# EasyEDA Pro project ProProject_Hauptplatine_ESP32.epro, schematic Schematic1
Create Date: 2024-03-31; Page Name: P1; Project Name: Hauptplatine_ESP32; Schematic Name: Schematic1; Update Date: 2024-03-31; Company: EasyEDA.com; Drawn: EasyEDA; Page Size: A4; Part Number: JLCPCB-002; Reviewed: EasyEDA; Version: V0.1
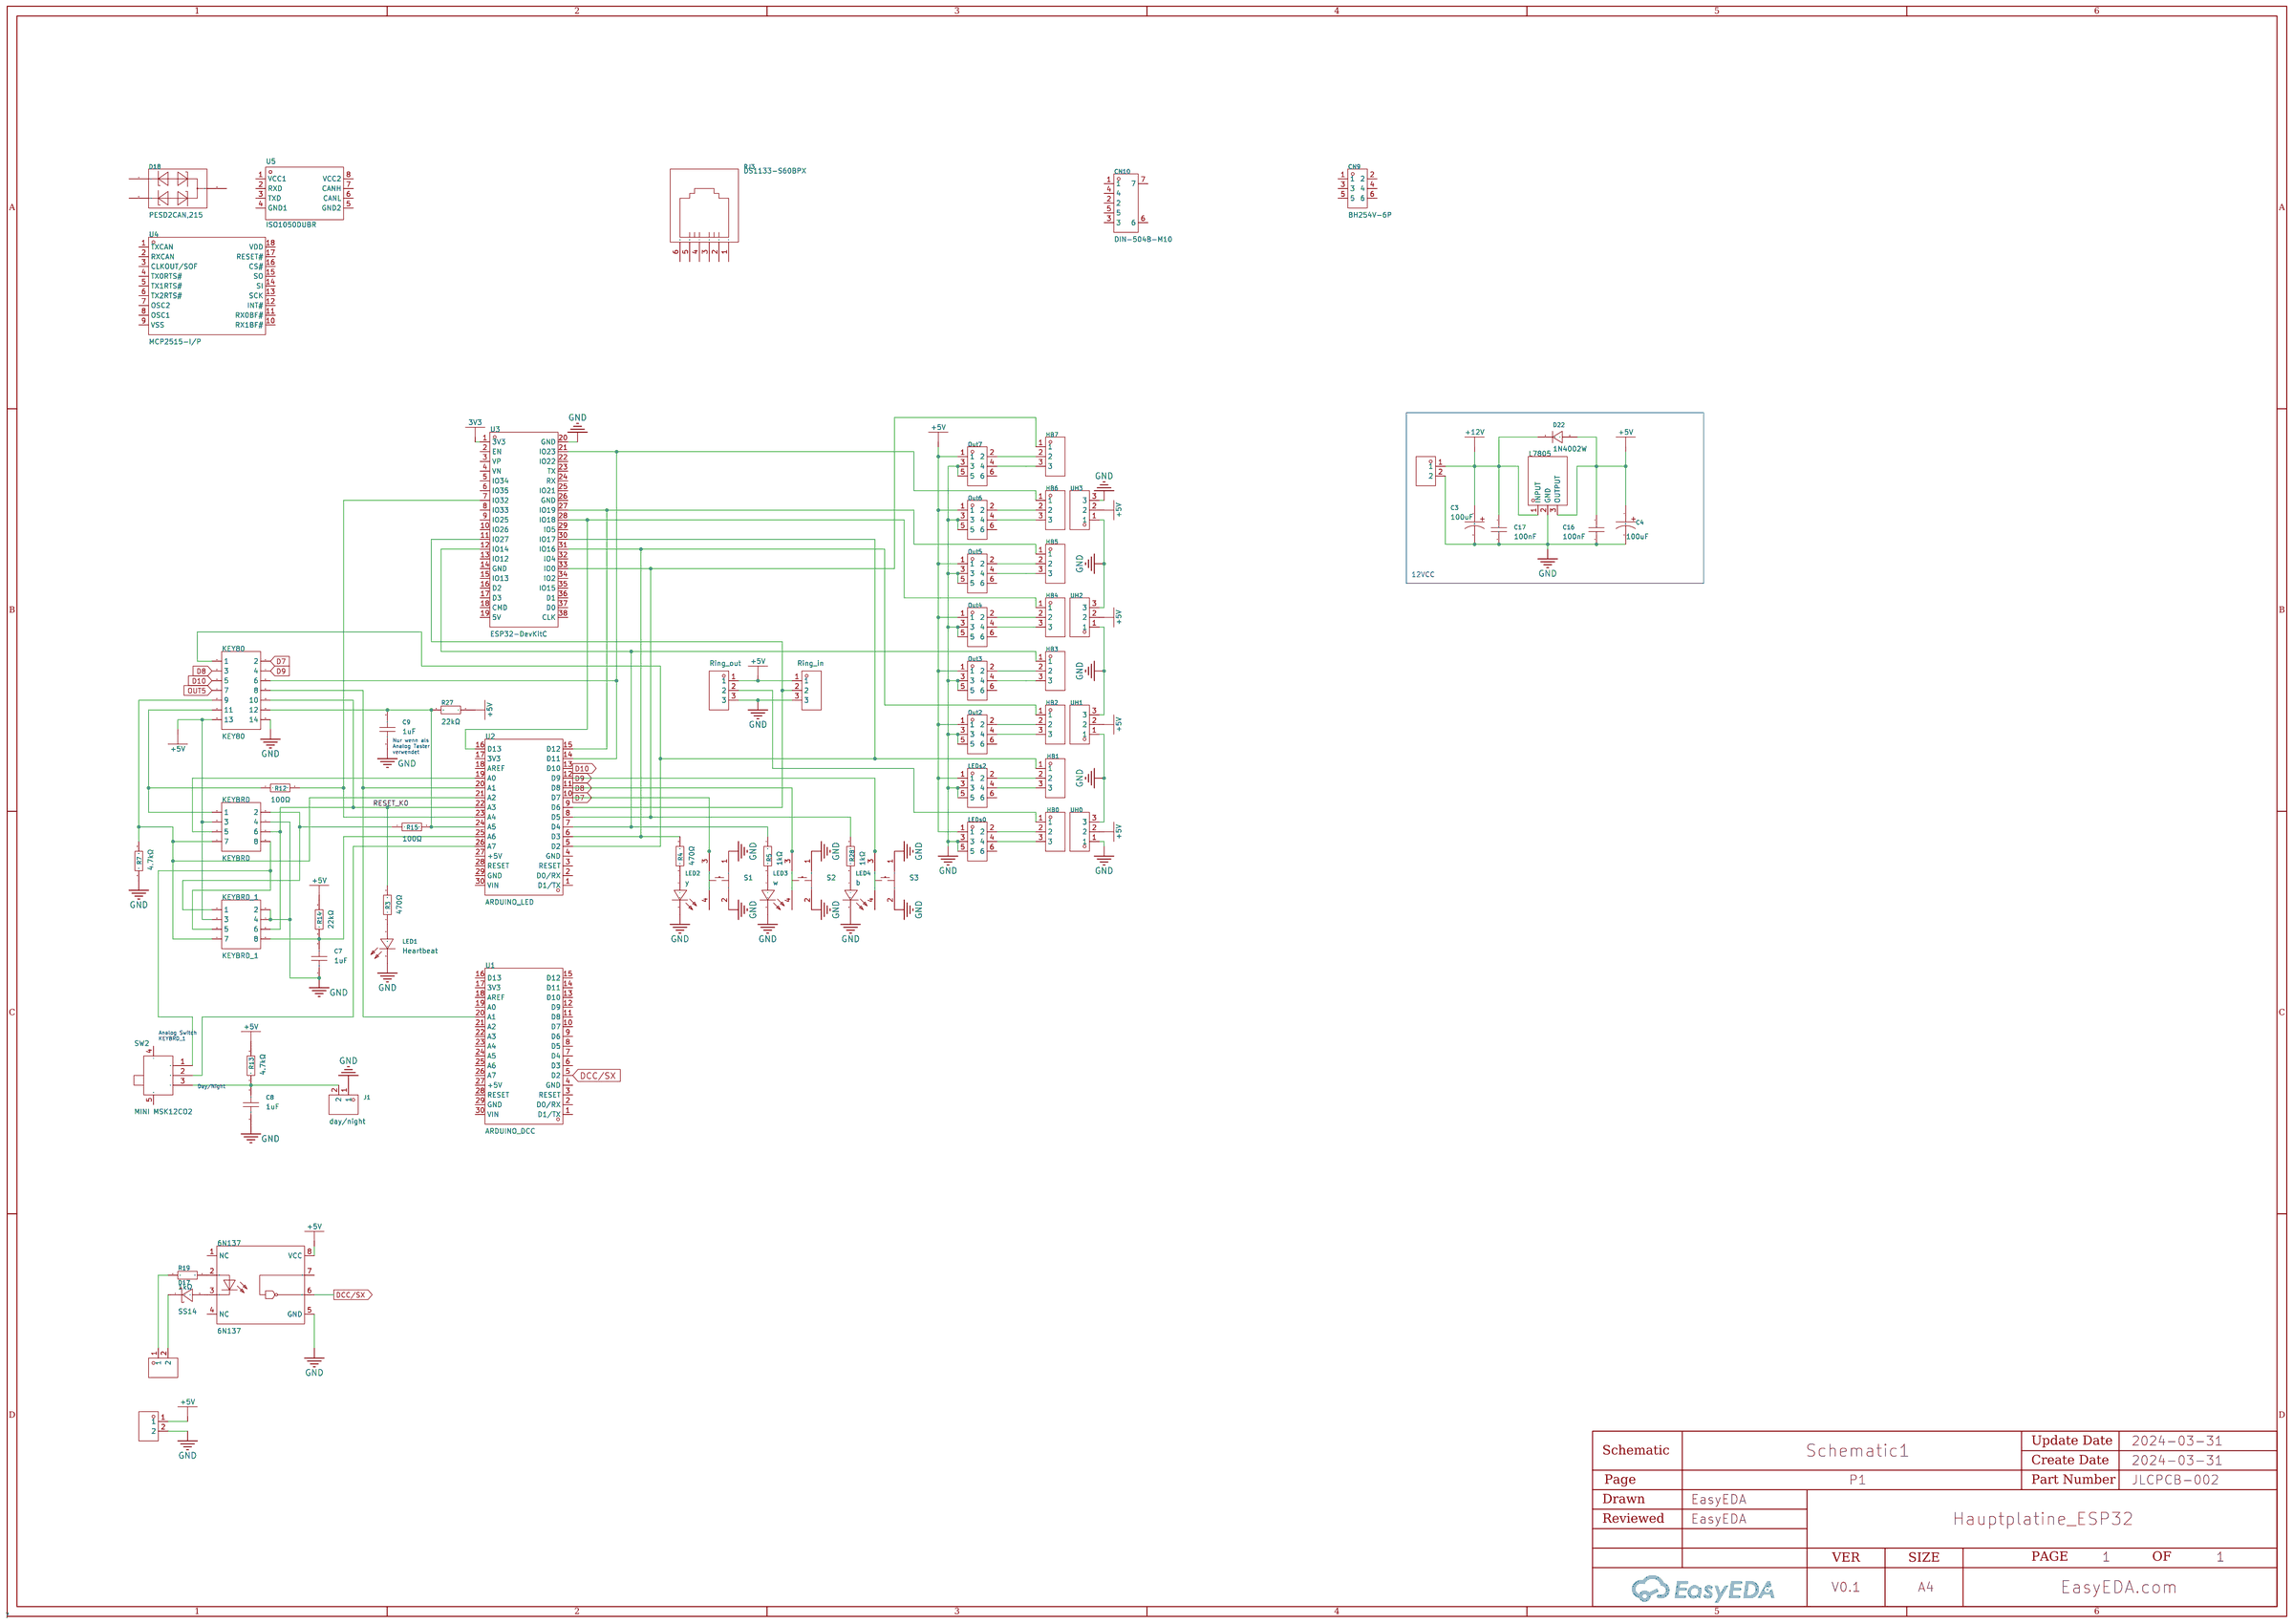
[diagram p8: schematic sheet]

## Parts
6N137  6N137  [DIP-8_L9.8-W6.6-P2.54-LS7.6-BL]
+5V  DB2ERC-3.5-2P-GN  [CONN-TH_2P-P3.50_DB2ERC-3.5-2P]
+5V1  DB2ERC-3.5-2P-GN  [CONN-TH_2P-P3.50_DB2ERC-3.5-2P]
C3  100uF  [CAP-TH_BD6.3-P2.50-D0.5-FD]
C4  100uF  [CAP-TH_BD6.3-P2.50-D0.5-FD]
C7  1uF  [C1206]
C8  1uF  [C1206]
C9  1uF  [C1206]
C16  100nF  [C1206]
C17  100nF  [C1206]
CN9  BH254V-6P  [IDC-TH_6P-P2.54-V-R2-C3-S2.54]
CN10  DIN-504B-M10  [CONN-TH_DIN-504B-M10]
D17  SS14  [SMA_L4.2-W2.6-LS5.3-RD]
D18  PESD2CAN,215  [SOT-23-3_L2.9-W1.3-P1.90-LS2.4-BR]
D22  1N4002W  [SOD-123F_L2.8-W1.8-LS3.7-RD]
DCC1  DB2ERC-3.5-2P-GN  [CONN-TH_2P-P3.50_DB2ERC-3.5-2P]
HB0  PM2.54-1*3  [HDR-TH_3P-P2.54-V-F]
HB1  PM2.54-1*3  [HDR-TH_3P-P2.54-V-F]
HB2  PM2.54-1*3  [HDR-TH_3P-P2.54-V-F]
HB3  PM2.54-1*3  [HDR-TH_3P-P2.54-V-F]
HB4  PM2.54-1*3  [HDR-TH_3P-P2.54-V-F]
HB5  PM2.54-1*3  [HDR-TH_3P-P2.54-V-F]
HB6  PM2.54-1*3  [HDR-TH_3P-P2.54-V-F]
HB7  PM2.54-1*3  [HDR-TH_3P-P2.54-V-F]
J1  day/night  [HDR-TH_2P-P2.54-V-M]
KEY80  KEY80  [IDC-TH_14P-P2.54-V-R2-C7-S2.54]
KEYBRD  KEYBRD  [IDC-TH_8P-P2.54-V-R2-C4-S2.54]
KEYBRD_1  KEYBRD_1  [IDC-TH_8P-P2.54-V-R2-C4-S2.54]
L7805  SL7805  [TO-220-3_L10.0-W4.5-P2.54-L]
LED1  Heartbeat  [LED1206-R-RD_GREEN]
LED2  y  [LED-TH_BD3.0-P2.54-FD]
LED3  w  [LED-TH_BD3.0-P2.54-FD]
LED4  b  [LED-TH_BD3.0-P2.54-FD]
LEDs0  BH254V-6P  [IDC-TH_6P-P2.54-V-R2-C3-S2.54]
LEDs2  BH254V-6P  [IDC-TH_6P-P2.54-V-R2-C3-S2.54]
Out2  BH254V-6P  [IDC-TH_6P-P2.54-V-R2-C3-S2.54]
Out3  BH254V-6P  [IDC-TH_6P-P2.54-V-R2-C3-S2.54]
Out4  BH254V-6P  [IDC-TH_6P-P2.54-V-R2-C3-S2.54]
Out5  BH254V-6P  [IDC-TH_6P-P2.54-V-R2-C3-S2.54]
Out6  BH254V-6P  [IDC-TH_6P-P2.54-V-R2-C3-S2.54]
Out7  BH254V-6P  [IDC-TH_6P-P2.54-V-R2-C3-S2.54]
R3  470Ω  [R1206]
R4  470Ω  [R1206]
R5  1kΩ  [R1206]
R7  4.7kΩ  [R1206]
R12  100Ω  [R1206]
R13  4.7kΩ  [R1206]
R14  22kΩ  [R1206]
R15  100Ω  [R1206]
R19  1kΩ  [R1206]
R27  22kΩ  [R1206]
R28  1kΩ  [R1206]
Ring_in  PM2.54-1*3  [HDR-TH_3P-P2.54-V-F]
Ring_out  PM2.54-1*3  [HDR-TH_3P-P2.54-V-F]
RJ3  DS1133-S60BPX  [RJ11-TH_DS1133-S60BPX]
S1  K2-1102DP-X4SW-04  [KEY-TH_4P-L6.2-W6.2-P4.50-LS6.5]
S2  K2-1102DP-X4SW-04  [KEY-TH_4P-L6.2-W6.2-P4.50-LS6.5]
S3  K2-1102DP-X4SW-04  [KEY-TH_4P-L6.2-W6.2-P4.50-LS6.5]
SW2  MINI MSK12CO2  [SW-SMD_MSK12CO2]
U1  ARDUINO_DCC  [COMM-TH_ARDUINO_NANO]
U2  ARDUINO_LED  [COMM-TH_ARDUINO_NANO]
U3  ESP32-DevKitC  [BULETM-SMD_ESP32-DEVKITC]
U4  MCP2515-I/P  [PDIP-18_L22.9-W6.4-P2.54-LS7.9-BL]
U5  ISO1050DUBR  [SOIC-8_L9.3-W6.6-P2.54-LS10.4-BL]
UH0  PM2.54-1*3  [HDR-TH_3P-P2.54-V-F]
UH1  PM2.54-1*3  [HDR-TH_3P-P2.54-V-F]
UH2  PM2.54-1*3  [HDR-TH_3P-P2.54-V-F]
UH3  PM2.54-1*3  [HDR-TH_3P-P2.54-V-F]

## Library data of the parts
6N137 = 6N137_C142297: Number of Channels:1 Isolation Voltage:5000V Input Type:DC Common Mode Transient Immunity (CMTI):- Data Rate:10Mbit/s Propagation Delay tpLH/tpHL:75ns,75ns Supply Voltage:- Supply Voltage:- Operating Temperature:-40℃~+85℃ Operating Temperature:-40℃~+85℃; Supplier Part: C142297; Manufacturer: EVERLIGHT(亿光); Supplier Footprint: DIP-8; JLCPCB Part Class: Extended Part; Datasheet: https://atta.szlcsc.com/upload/public/pdf/source/20171110/C142297_15102792608691104240.PDF; Supplier: LCSC; Number of Channels: 1; Isolation Voltage: 5000V; Input Type: DC; Data Rate: 10Mbit/s; Propagation Delay tpLH/tpHL: 75ns,75ns; Operating Temperature: -40℃~+85℃
+5V +5V1 DCC1 = DB2ERC-3.5-2P-GN: Connector Type:板端/Receptacle-Close Pitch:3.5mm Structure:1x2P Number of Rows:1 Number of PINs Per Row:2 Number of Pins:2P Current Rating (Max):10A Voltage Rating (Max):250V Operating Temperature Range:-40℃~+105℃ Operating Temperature Range:-40℃~+105℃ Colo; LCSC Part Name: 3.5mm 1x2P 排数:1 每排P数:2; Supplier Part: C395830; Manufacturer: DIBO(地博电气); Supplier Footprint: 弯插,P=3.5mm; JLCPCB Part Class: Extended Part; Datasheet: https://atta.szlcsc.com/upload/public/pdf/source/20230327/B3D6220F4540DBC069FF6ECCFA34901A.pdf; Supplier: LCSC; Connector Type: 板端/Receptacle-Close; Pitch: 3.5mm; Structure: 1x2P; Number of Rows: 1; Number of PINs Per Row: 2; Number of Pins: 2P; Current Rating (Max): 10A; Voltage Rating (Max): 250V; Operating Temperature Range: -40℃~+105℃; Color: Green; Mounting Style: Bend
C3 C4 = 25YXG100MLLCT16.3X11: Capacitance: Tolerance:±20% Tolerance:±20% Rated Voltage: Ripple Current:- Equivalent Series Resistance(ESR):- Lead Spacing:2.5mm φD: L: Lifetime @ Temp:- Operating Temperature:-40℃~+105℃ Operating Temperature:-40℃~+105℃; LCSC Part Name: 100uF ±20% 25V; Supplier Part: C2920634; Manufacturer: rubycon(红宝石); Supplier Footprint: 插件,D6.3xL11mm; JLCPCB Part Class: Extended Part; Datasheet: https://atta.szlcsc.com/upload/public/pdf/source/20210612/F52F916FD8B4A974E1BEE08EDCCE5161.pdf; Supplier: LCSC; Tolerance: ±20%; Lead Spacing: 2.5mm; Operating Temperature: -40℃~+105℃
C7-C9 = CL31B105KCHNNNE: Capacitance: Tolerance:±10% Tolerance:±10% Voltage Rated: Temperature Coefficient:; LCSC Part Name: 1uF ±10% 100V; Supplier Part: C13832; Manufacturer: SAMSUNG(三星); Supplier Footprint: 1206; JLCPCB Part Class: Extended Part; Datasheet: https://atta.szlcsc.com/upload/public/pdf/source/20160218/1457707763339.pdf; Supplier: LCSC; Tolerance: ±10%
C16 C17 = CC1206KKX7R0BB104: Capacitance: Tolerance:±10% Tolerance:±10% Voltage Rated: Temperature Coefficient:; LCSC Part Name: 100nF ±10% 100V; Supplier Part: C107181; Manufacturer: YAGEO(国巨); Supplier Footprint: 1206; JLCPCB Part Class: Extended Part; Datasheet: https://atta.szlcsc.com/upload/public/pdf/source/20180906/C282243_51A53A5345E69C6665D4E8CFC2B98E68.pdf; Supplier: LCSC; Tolerance: ±10%
CN9 LEDs0 LEDs2 Out2-Out7 = BH254V-6P: Connector Type:简牛座 Pitch:2.54mm Structure:2x3P Current Rating (Max):3A Voltage Rating (Max):250V Holder Type:Straight Row Spacing:2.54mm Number of Rows:2 Pin Number in each Row:3 Operating Temperature Range:-40℃~+105℃ Operating Temperature Range:-40℃~+105; LCSC Part Name: 2.54mm 2x3P 排数:2 每排P数:3; Supplier Part: C492441; Manufacturer: XFCN(兴飞); Supplier Footprint: 插件,P=2.54mm; JLCPCB Part Class: Extended Part; Datasheet: https://atta.szlcsc.com/upload/public/pdf/source/20200312/C492444_4AABE2FC4F6BE8226B85135616AF0092.pdf; Supplier: LCSC; Connector Type: 简牛座; Pitch: 2.54mm; Structure: 2x3P; Current Rating (Max): 3A; Voltage Rating (Max): 250V; Holder Type: Straight; Row Spacing: 2.54mm; Number of Rows: 2; Pin Number in each Row: 3; Operating Temperature Range: -40℃~+105℃
CN10 = DIN-504B-M10: Supplier: LCSC; Supplier Part: C2939346; Manufacturer: HOOYA(皓宇电子); JLCPCB Part Class: Extended Part; Supplier Footprint: 插件; Datasheet: https://atta.szlcsc.com/upload/public/pdf/source/20220120/ABB2570656C6359DBC61E5C1017AC323.pdf
D17 = SS14_C2480: Diode Configuration:Single Forward Voltage (Vf@If):550mV@1A Reverse Voltage (Vr):40V Average Rectified Current (Io):1A Reverse Leakage Current (Ir):500uA@40V; LCSC Part Name: 电压:40V 电流:1A; Supplier Part: C2480; Manufacturer: MDD; Supplier Footprint: SMA(DO-214AC); JLCPCB Part Class: Basic Part; Datasheet: https://atta.szlcsc.com/upload/public/pdf/source/20230712/2DB6064CFBB99DE6DB116BEE8208BE66.pdf; Supplier: LCSC; Diode Configuration: Single; Forward Voltage (Vf@If): 550mV@1A; Reverse Voltage (Vr): 40V; Average Rectified Current (Io): 1A; Reverse Leakage Current (Ir): 500uA@40V
D18 = PESD2CAN,215: polarity:Bi-Directional Reverse Stand-Off Voltage (Vrwm):24V Maximum Clamping Voltage:41V Peak Pulse Current (Ipp)@10/1000us:5A Peak Pulse Power Dissipation (Ppp)@10/1000us:230W Breakdown Voltage:26.2V Number of Lines:双路 Operating Temperature:-55℃~+150℃@(; LCSC Part Name: 双向ESD; Supplier Part: C75176; Manufacturer: Nexperia(安世); Supplier Footprint: SOT-23; JLCPCB Part Class: Extended Part; Datasheet: https://atta.szlcsc.com/upload/public/pdf/source/20170505/1493951386298.pdf; Supplier: LCSC; polarity: Bi-Directional; Reverse Stand-Off Voltage (Vrwm): 24V; Maximum Clamping Voltage: 41V; Peak Pulse Current (Ipp)@10/1000us: 5A; Peak Pulse Power Dissipation (Ppp)@10/1000us: 230W; Breakdown Voltage: 26.2V; Number of Lines: 双路; Operating Temperature: -55℃~+150℃@(Ta); Type: ESD
D22 = 1N4002W: Diode Configuration: Forward Voltage (Vf@If):1.1V@1A Reverse Voltage (Vr): Average Rectified Current (Io): Reverse Leakage Current:5uA@100V; LCSC Part Name: 电压:100V 电流:1A; Supplier Part: C169542; Manufacturer: 晶导微电子; Supplier Footprint: SOD-123F; JLCPCB Part Class: Extended Part; Datasheet: https://atta.szlcsc.com/upload/public/pdf/source/20180125/C169542_15168663743361303221.pdf; Supplier: LCSC; Forward Voltage (Vf@If): 1.1V@1A; Reverse Leakage Current: 5uA@100V
HB0-HB7 Ring_in Ring_out UH0-UH3 = PM2.54-1*3: Holes Structure:1x3P Pitch:2.54mm Row Spacing:2.54mm Circular Hole / Square Hole:方孔 Mounting Type:Straight Number of Rows:Plugin Number of Holes:3P Current Rating (Max):2.5A Holes Direction:Top Insulation Height:8.5mm Operating Temperature Range:-40℃~+105; LCSC Part Name: 间距:2.54mm 1x3P 直插; Supplier Part: C5116529; Manufacturer: ZHOURI(洲日); Supplier Footprint: 插件,P=2.54mm; JLCPCB Part Class: Extended Part; Datasheet: https://atta.szlcsc.com/upload/public/pdf/source/20220729/0B9CDCB2053AD78CED9CDFEF888323E9.pdf; Supplier: LCSC; Holes Structure: 1x3P; Pitch: 2.54mm; Row Spacing: 2.54mm; Circular Hole / Square Hole: 方孔; Mounting Type: Straight; Number of Rows: Plugin; Number of Holes: 3P; Current Rating (Max): 2.5A; Holes Direction: Top; Insulation Height: 8.5mm; Operating Temperature Range: -40℃~+105℃
J1 = PZ254V-11-02P: Pin Structure:1x2P Pitch:2.54mm Row Spacing:- Circluar Pins/Square Pins:Square Pins Mounting Type:Straight Number of Rows:Plugin Number of Pins:2P Current Rating (Max):- Voltage Rating (Max):- Length of Mating Pin:6mm Insulation Height:2.5mm Length of End; LCSC Part Name: 间距:2.54mm 1x2P 直插 方针; Supplier Part: C492401; Manufacturer: XFCN(兴飞); Supplier Footprint: 插件,P=2.54mm; JLCPCB Part Class: Extended Part; Datasheet: https://atta.szlcsc.com/upload/public/pdf/source/20200309/C492401_A812433581A9B211A7FFA413ADDFF0E5.pdf; Supplier: LCSC; Pin Structure: 1x2P; Pitch: 2.54mm; Circluar Pins/Square Pins: Square Pins; Mounting Type: Straight; Number of Rows: Plugin; Number of Pins: 2P; Length of Mating Pin: 6mm; Insulation Height: 2.5mm; Length of End Connection Pin: 3mm; Operating Temperature Range: -40℃~+105℃; Color: Black
KEY80 = 2.54-2*7P简牛: Connector Type:简牛座 Pitch:2.54mm Structure:2x7P Holder Type:Straight Row Spacing:2.54mm Number of Rows:2 Pin Number in each Row:7 Contact Material:Brass Contact Plating:Gold; LCSC Part Name: 2.54mm 2x7P 排数:2 每排P数:7; Supplier Part: C11215; Manufacturer: BOOMELE(博穆精密); Supplier Footprint: 插件,P=2.54mm; JLCPCB Part Class: Extended Part; Datasheet: https://atta.szlcsc.com/upload/public/pdf/source/20131122/1457706661483.pdf; Supplier: LCSC; Connector Type: 简牛座; Pitch: 2.54mm; Structure: 2x7P; Holder Type: Straight; Row Spacing: 2.54mm; Number of Rows: 2; Pin Number in each Row: 7; Contact Material: Brass; Contact Plating: Gold
KEYBRD KEYBRD_1 = 2.54-2*4P简牛: Connector Type:简牛座 Pitch:2.54mm Structure:2x4P Holder Type:Straight Row Spacing:2.54mm Number of Rows:2 Pin Number in each Row:4 Contact Material:- Contact Plating:-; LCSC Part Name: 2.54mm 2x4P 排数:2 每排P数:4; Supplier Part: C9135; Manufacturer: BOOMELE(博穆精密); Supplier Footprint: 插件,P=2.54mm; JLCPCB Part Class: Extended Part; Datasheet: https://atta.szlcsc.com/upload/public/pdf/source/20131122/1457706661483.pdf; Supplier: LCSC; Connector Type: 简牛座; Pitch: 2.54mm; Structure: 2x4P; Holder Type: Straight; Row Spacing: 2.54mm; Number of Rows: 2; Pin Number in each Row: 4
L7805 = SL7805: Output Type: Maximum Input Voltage:25V Output Voltage:5V Output Voltage:5V MAX Output Current:1A Power Supply Rejection Ratio (PSRR):80dB@(120Hz) Dropout Voltage:2V@(500mA) Output Polarity:Positive electrode Number of Outputs:1; LCSC Part Name: 输入25V 输出5V 1A; Supplier Part: C458977; Manufacturer: Slkor(萨科微); Supplier Footprint: TO-220; JLCPCB Part Class: Extended Part; Datasheet: https://atta.szlcsc.com/upload/public/pdf/source/20191121/C458981_9DD15B91274201511A06C1D3EFC65831.pdf; Supplier: LCSC; Maximum Input Voltage: 25V; Output Voltage: 5V; MAX Output Current: 1A; Power Supply Rejection Ratio (PSRR): 80dB@(120Hz); Dropout Voltage: 2V@(500mA); Output Polarity: Positive electrode; Number of Outputs: 1
LED1 = XL-3216UGC: Emitted Color:Emerald Power Dissipation:80mW Forward Current:25mA Dominant Wavelength:516nm~525nm Dominant Wavelength:516nm~525nm Peak Wavelength:534nm Lens Color:无色透明透镜 Color Temperature:- Color Temperature:- Viewing Angle:120° Mounting Sytle:Positive po; Supplier Part: C965825; Manufacturer: XINGLIGHT(成兴光); Supplier Footprint: 1206; JLCPCB Part Class: Extended Part; Datasheet: https://atta.szlcsc.com/upload/public/pdf/source/20221102/F627D30E1E7D99B6115BC150FFFF1508.pdf; Supplier: LCSC; Emitted Color: Emerald; Power Dissipation: 80mW; Forward Current: 25mA; Dominant Wavelength: 516nm~525nm; Peak Wavelength: 534nm; Lens Color: 无色透明透镜; Viewing Angle: 120°; Mounting Sytle: Positive post; Operating Temperature: -30℃~+85℃
LED2-LED4 = MHL3014GTS: Lamp Holder Type:3mm圆形灯头 Emitted Color:Green-yellow Power Dissipation:78mW Forward Current:20mA Dominant Wavelength:570nm Dominant Wavelength:570nm Peak Wavelength:572nm Diode Configuration:- Lens Color:雾状白透镜 Color Temperature:- Color Temperature:- Viewin; LCSC Part Name: 普绿/黄绿; Supplier Part: C397054; Manufacturer: MEIHUA(美华); Supplier Footprint: 插件,D=3mm; JLCPCB Part Class: Extended Part; Datasheet: https://atta.szlcsc.com/upload/public/pdf/source/20190613/C397054_81FF8A379DDCAE47426055BE42C5DA0E.pdf; Supplier: LCSC; Lamp Holder Type: 3mm圆形灯头; Emitted Color: Green-yellow; Power Dissipation: 78mW; Forward Current: 20mA; Dominant Wavelength: 570nm; Peak Wavelength: 572nm; Lens Color: 雾状白透镜; Viewing Angle: 40°; Operating Temperature: -25℃~+85℃
R3 R4 = 1206W4F4700T5E: Type:Thick Film Resistors Resistance: Tolerance:±1% Tolerance:±1% Power(Watts): Overload Voltage (Max): Temperature Coefficient:±100ppm/℃ Temperature Coefficient:±100ppm/℃ Operating Temperature Range:-55℃~+155℃ Operating Temperature Range:-55℃~+155℃; LCSC Part Name: 470Ω ±1% 250mW 厚膜电阻; Supplier Part: C4502; Manufacturer: UNI-ROYAL(厚声); Supplier Footprint: 1206; JLCPCB Part Class: Extended Part; Datasheet: https://atta.szlcsc.com/upload/public/pdf/source/20200306/C422600_1E6D84923E4A46A82E41ADD87F860B5C.pdf; Supplier: LCSC; Type: Thick Film Resistors; Tolerance: ±1%; Temperature Coefficient: ±100ppm/℃; Operating Temperature Range: -55℃~+155℃
R5 R19 R28 = 1206W4F1001T5E_C4410: Resistance:1000Ω Tolerance:±1% Tolerance:±1% Power(Watts): Overload Voltage (Max): Type:Thick Film Resistors Operating Temperature Range:-55℃~+155℃ Operating Temperature Range:-55℃~+155℃; LCSC Part Name: 1kΩ ±1% 250mW 厚膜电阻; Supplier Part: C4410; Manufacturer: UNI-ROYAL(厚声); Manufacturer Part: 1206W4F1001T5E; Supplier Footprint: 1206; JLCPCB Part Class: Basic Part; Datasheet: https://atta.szlcsc.com/upload/public/pdf/source/20200306/C422600_1E6D84923E4A46A82E41ADD87F860B5C.pdf; Supplier: LCSC; Tolerance: ±1%; Type: Thick Film Resistors; Operating Temperature Range: -55℃~+155℃
R7 R13 = 1206W4F4701T5E: Type:Thick Film Resistors Resistance:4.7kΩ Tolerance:±1% Tolerance:±1% Power(Watts): Overload Voltage (Max): Temperature Coefficient:±100ppm/℃ Temperature Coefficient:±100ppm/℃ Operating Temperature Range:-55℃~+155℃ Operating Temperature Range:-55℃~+155℃; LCSC Part Name: 4.7kΩ ±1% 250mW 厚膜电阻; Supplier Part: C17936; Manufacturer: UNI-ROYAL(厚声); Supplier Footprint: 1206; JLCPCB Part Class: Basic Part; Datasheet: https://atta.szlcsc.com/upload/public/pdf/source/20200306/C422600_1E6D84923E4A46A82E41ADD87F860B5C.pdf; Supplier: LCSC; Type: Thick Film Resistors; Tolerance: ±1%; Temperature Coefficient: ±100ppm/℃; Operating Temperature Range: -55℃~+155℃
R12 R15 = 1206W4F1000T5E_C17901: Type:Thick Film Resistors Resistance: Tolerance:±1% Tolerance:±1% Power(Watts): Overload Voltage (Max): Temperature Coefficient:±100ppm/℃ Temperature Coefficient:±100ppm/℃ Operating Temperature Range:-55℃~+155℃ Operating Temperature Range:-55℃~+155℃; LCSC Part Name: 100Ω ±1% 250mW 厚膜电阻; Supplier Part: C17901; Manufacturer: UNI-ROYAL(厚声); Manufacturer Part: 1206W4F1000T5E; Supplier Footprint: 1206; JLCPCB Part Class: Basic Part; Datasheet: https://atta.szlcsc.com/upload/public/pdf/source/20200306/C422600_1E6D84923E4A46A82E41ADD87F860B5C.pdf; Supplier: LCSC; Type: Thick Film Resistors; Tolerance: ±1%; Temperature Coefficient: ±100ppm/℃; Operating Temperature Range: -55℃~+155℃
R14 R27 = 1206W4F2202T5E: Type:Thick Film Resistors Resistance:22kΩ Tolerance:±1% Tolerance:±1% Power(Watts): Overload Voltage (Max): Temperature Coefficient:±100ppm/℃ Temperature Coefficient:±100ppm/℃ Operating Temperature Range:-55℃~+155℃ Operating Temperature Range:-55℃~+155℃; LCSC Part Name: 22kΩ ±1% 250mW 厚膜电阻; Supplier Part: C25830; Manufacturer: UNI-ROYAL(厚声); Supplier Footprint: 1206; JLCPCB Part Class: Extended Part; Datasheet: https://atta.szlcsc.com/upload/public/pdf/source/20200306/C422600_1E6D84923E4A46A82E41ADD87F860B5C.pdf; Supplier: LCSC; Type: Thick Film Resistors; Tolerance: ±1%; Temperature Coefficient: ±100ppm/℃; Operating Temperature Range: -55℃~+155℃
RJ3 = DS1133-S60BPX: Connector Type:RJReceptacle USOC Codes:RJ12 Number of Ports:1 Shielding:- LED:- Ratings:-; LCSC Part Name: RJ12; Supplier Part: C77859; Manufacturer: CONNFLY; Supplier Footprint: 插件; JLCPCB Part Class: Extended Part; Datasheet: https://atta.szlcsc.com/upload/public/pdf/source/20180529/C77859_3164FC81ACC4F2D8B15A2684EF7DB4A9.pdf; Supplier: LCSC; Connector Type: RJReceptacle; USOC Codes: RJ12; Number of Ports: 1
S1-S3 = K2-1102DP-X4SW-04: Contact Current:50mA Voltage Rating (DC):12V Insulation Resistance:100MΩ Circuit:SPST Mounting Sytle:Straight Actuator Style:Round Button With Lamp:- Operating Force:250gf@±30gf Mechanical Life:100000 Operating Temperature:-25℃~+85℃ Operating Temperature:; Supplier Part: C136671; Manufacturer: 韩国韩荣; Supplier Footprint: 6x6mm; JLCPCB Part Class: Extended Part; Datasheet: https://atta.szlcsc.com/upload/public/pdf/source/20210810/D0CD9D77408EACA829A5E533AC6E5B1E.pdf; Supplier: LCSC; Contact Current: 50mA; Voltage Rating (DC): 12V; Insulation Resistance: 100MΩ; Circuit: SPST; Mounting Sytle: Straight; Actuator Style: Round Button; Operating Force: 250gf@±30gf; Mechanical Life: 100000; Operating Temperature: -25℃~+85℃; Switch Length: 6mm; Switch Width: 6mm; Switch Height: 17mm
SW2 = MINI MSK12CO2: Circuit:SPDT Actuator Style:- Pin Style:SMDSplicing Switch Length:5mm Switch Width:2.75mm Switch Height:1.4mm Mounting Style:卧贴 Actuator Color:- Current Rating (DC):50mA Voltage Rating (DC):12V Current Rating (AC):- Voltage Rating (AC):- Mechanical Life:1; LCSC Part Name: 迷你七脚两档侧拨拨动 mini七7脚 微型拨动; Supplier Part: C2681570; Manufacturer: SHOU HAN(首韩); Supplier Footprint: SMD; JLCPCB Part Class: Extended Part; Datasheet: https://atta.szlcsc.com/upload/public/pdf/source/20210224/C2681570_D263F9C605E4588A4AE6114B72AE4C72.pdf; Supplier: LCSC; Circuit: SPDT; Pin Style: SMDSplicing; Switch Length: 5mm; Switch Width: 2.75mm; Switch Height: 1.4mm; Mounting Style: 卧贴; Current Rating (DC): 50mA; Voltage Rating (DC): 12V; Mechanical Life: 1万次; Operating Temperature: -16℃~+60℃
U1 U2 = ARDUINO_NANO: Supplier Part: C9900017879; Supplier Footprint: 插件; JLCPCB Part Class: Extended Part; Supplier: LCSC
U3 = ESP32-DevKitC: CPU:- ROM Size:- Number of I/O: USB:- WIFI Protocols:- Bluetooth:- Ethernet:- Audio & Video Interface:- Multimedia Support:- Card Type:- Power Supply Type:- Power Supply:- POE Support:- Resolution:- Temperature Range:-; LCSC Part Name: 开发板; Supplier Part: C571180; Manufacturer: ESPRESSIF(乐鑫); JLCPCB Part Class: Extended Part; Datasheet: https://atta.szlcsc.com/upload/public/pdf/source/20200521/C529586_D6FCDAFCFF160B3EDDF7DF28D600699D.pdf; Supplier: LCSC
U4 = MCP2515-I/P: Type: Supply Voltage:2.7V~5.5V Supply Voltage:2.7V~5.5V Supply Current:10mA Operating Temperature:-40℃~+85℃ Operating Temperature:-40℃~+85℃; Supplier Part: C469036; Manufacturer: MICROCHIP(美国微芯); Supplier Footprint: PDIP-18; JLCPCB Part Class: Extended Part; Datasheet: https://atta.szlcsc.com/upload/public/pdf/source/20221017/BDBFE05E0D5D8625D853A9E85ECBB005.pdf; Supplier: LCSC; Supply Voltage: 2.7V~5.5V; Supply Current: 10mA; Operating Temperature: -40℃~+85℃
U5 = ISO1050DUBR: Type:Transceiver；隔离器 Data Rate:1Mbps Supply Voltage:3V~5.5V Supply Voltage:3V~5.5V Operating Temperature:-55℃~+105℃ Operating Temperature:-55℃~+105℃; LCSC Part Name: 1Mbps 3V~5.5V; Supplier Part: C16428; Manufacturer: TI(德州仪器); Supplier Footprint: SOP-8; JLCPCB Part Class: Extended Part; Datasheet: https://www.ti.com/cn/lit/gpn/iso1050; Supplier: LCSC; Type: Transceiver；隔离器; Data Rate: 1Mbps; Supply Voltage: 3V~5.5V; Operating Temperature: -55℃~+105℃

## Nets
3V3: U3.1(3V3)
+5V: 6N137.8(VCC) +5V.1 C4.1 C16.1 D22.2(A) KEY80.13 KEYBRD.3 KEYBRD_1.3 L7805.3(OUTPUT) LEDs0.1 LEDs2.1 Out2.1 Out3.1 Out4.1 Out5.1 Out6.1 Out7.1 R13.2 R14.1 R27.1 Ring_in.1 Ring_out.1 UH0.2 UH1.2 UH2.2 UH3.2
+12V: +5V1.1 C3.1 C17.1 D22.1(C) L7805.1(INPUT)
GND: 6N137.5(GND) +5V.2 +5V1.2 C3.2 C4.2 C7.1 C8.1 C9.1 C16.2 C17.2 J1.1 KEY80.14 KEYBRD.4 KEYBRD_1.2 KEYBRD_1.4 L7805.2(GND) LED1.2(K) LED2.2(K) LED3.2(K) LED4.2(K) LEDs0.3 LEDs0.5 LEDs2.3 LEDs2.5 Out2.3 Out2.5 Out3.3 Out3.5 Out4.3 Out4.5 Out5.3 Out5.5 Out6.3 Out6.5 Out7.3 Out7.5 R7.1 Ring_in.3 Ring_out.3 S1.1 S1.2 S2.1 S2.2 S3.1 S3.2 U3.20(GND) UH0.1 UH0.3 UH1.1 UH1.3 UH2.1 UH2.3 UH3.1 UH3.3
D7: KEY80.2 S1.3 S1.4 U2.10(D7)
D8: KEY80.3 S2.3 S2.4 U2.11(D8)
D9: KEY80.4 S3.3 S3.4 U2.12(D9)
D10: KEY80.5 U2.13(D10)
DCC/SX: 6N137.6(VOUT) U1.5(D2)
OUT5: KEY80.7
RESET_K0: KEY80.10 KEYBRD.6 KEYBRD_1.6 R3.2 U2.22(A3)
$1N1187: DCC1.1 R19.2
$1N1188: D17.1(K) DCC1.2
$1N1189: 6N137.2(AN) R19.1
$1N1190: 6N137.3(CAT) D17.2(A)
$1N1986: KEYBRD.2 KEYBRD_1.1 R15.1
$1N2005: C9.2 KEY80.12 R15.2 R27.2 U2.24(A5)
$1N2586: KEY80.8 U1.20(A1) U2.20(A1)
$1N2626: KEY80.9 KEYBRD.7 KEYBRD_1.7 R7.2 U2.21(A2)
$1N2750: KEY80.11 KEYBRD.1 R12.1
$1N3086: KEYBRD.5 U2.19(A0)
$1N3216: C7.2 KEYBRD_1.8 R14.2 U2.25(A6)
$1N3936: C8.2 J1.2 R13.1 SW2.3
$1N5216: LED2.1(A) R4.1
$1N5296: LED3.1(A) R5.2
$1N5376: LED4.1(A) R28.2
$1N7443: LED1.1(A) R3.1
$1N14033: HB4.1 U2.16(D13) U3.28(IO18)
$1N15290: HB6.1 KEY80.6 U2.14(D11) U3.21(IO23)
$1N15301: HB5.1 U2.15(D12) U3.27(IO19)
$1N15328: HB7.1 R28.1 U2.8(D5) U3.33(IO0)
$1N15339: HB3.1 R5.1 U2.7(D4) U3.12(IO14)
$1N15360: HB2.1 R4.2 U2.6(D3) U3.31(IO16)
$1N15410: HB0.1 Ring_out.2
$1N15431: R12.2 U2.23(A4) U3.7(IO32)
$1N15453: HB1.1 KEY80.1 U2.5(D2) U3.30(IO17)
$1N15556: Ring_in.2 U2.9(D6) U3.11(IO27)
$1N15628: KEYBRD.8 KEYBRD_1.5 SW2.1
$1N15658: SW2.2 U2.26(A7)
Net-(HB0-2): HB0.2 LEDs0.2
Net-(HB0-3): HB0.3 LEDs0.4
Net-(HB1-2): HB1.2 LEDs2.2
Net-(HB1-3): HB1.3 LEDs2.4
Net-(HB2-2): HB2.2 Out2.2
Net-(HB2-3): HB2.3 Out2.4
Net-(HB3-2): HB3.2 Out3.2
Net-(HB3-3): HB3.3 Out3.4
Net-(HB4-2): HB4.2 Out4.2
Net-(HB4-3): HB4.3 Out4.4
Net-(HB5-2): HB5.2 Out5.2
Net-(HB5-3): HB5.3 Out5.4
Net-(HB6-2): HB6.2 Out6.2
Net-(HB6-3): HB6.3 Out6.4
Net-(HB7-2): HB7.2 Out7.2
Net-(HB7-3): HB7.3 Out7.4

Not connected (* = marked no-connect by the designer): 6N137 1(NC) 4(NC) 7(VE); CN9 1 2 3 4 5 6; CN10 1 2 3 4 5 6 7; D18 1 2 3; LEDs0 6; LEDs2 6; Out2 6; Out3 6; Out4 6; Out5 6; Out6 6; Out7 6; RJ3 1 2 3 4 5 6; SW2 4 5; U1 1(D1/TX) 2(D0/RX) 3(RESET) 4(GND) 6(D3) 7(D4) 8(D5) 9(D6) 10(D7) 11(D8) 12(D9) 13(D10) 14(D11) 15(D12) 16(D13) 17(3V3) 18(AREF) 19(A0) 21(A2) 22(A3) 23(A4) 24(A5) 25(A6) 26(A7) 27(+5V) 28(RESET) 29(GND) 30(VIN); U2 1(D1/TX) 2(D0/RX) 3(RESET) 4(GND) 17(3V3) 18(AREF) 27(+5V) 28(RESET) 29(GND) 30(VIN); U3 2(EN) 3(VP) 4(VN) 5(IO34) 6(IO35) 8(IO33) 9(IO25) 10(IO26) 13(IO12) 14(GND) 15(IO13) 16(D2) 17(D3) 18(CMD) 19(5V) 22(IO22) 23(TX) 24(RX) 25(IO21) 26(GND) 29(IO5) 32(IO4) 34(IO2) 35(IO15) 36(D1) 37(D0) 38(CLK); U4 1(TXCAN) 2(RXCAN) 3(CLKOUT/SOF) 4(TX0RTS#) 5(TX1RTS#) 6(TX2RTS#) 7(OSC2) 8(OSC1) 9(VSS) 10(RX1BF#) 11(RX0BF#) 12(INT#) 13(SCK) 14(SI) 15(SO) 16(CS#) 17(RESET#) 18(VDD); U5 1(VCC1) 2(RXD) 3(TXD) 4(GND1) 5(GND2) 6(CANL) 7(CANH) 8(VCC2)

## Notes on the sheet
- 12VCC
- Nur wenn als
  Analog Taster
  verwendet
- Analog Switch
  KEYBRD_1
- Day/Night
